# EAGLE design AD5204 (EAGLE 6.3)
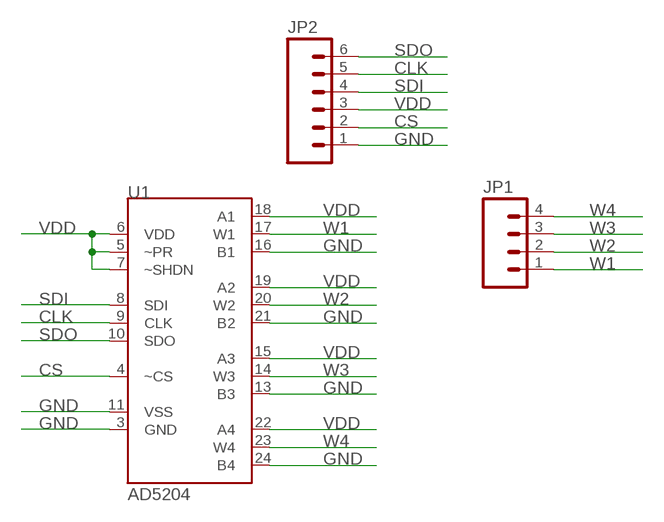
[diagram p0: schematic, sheet 1]

## Parts
JP1  M04PTH  [1X04]
JP2  M06SIP  [1X06]
U1  AD5204  [SO24W]

## Nets
CLK: JP2.5 U1.9(CLK)
CS: JP2.2 U1.4(~CS)
GND: JP2.1 U1.3(GND) U1.11(VSS) U1.13(B3) U1.16(B1) U1.21(B2) U1.24(B4)
SDI: JP2.4 U1.8(SDI)
SDO: JP2.6 U1.10(SDO)
VDD: JP2.3 U1.5(~PR) U1.6(VDD) U1.7(~SHDN) U1.15(A3) U1.18(A1) U1.19(A2) U1.22(A4)
W1: JP1.1 U1.17(W1)
W2: JP1.2 U1.20(W2)
W3: JP1.3 U1.14(W3)
W4: JP1.4 U1.23(W4)

## Library data of the parts
JP1 = SparkFun-Connectors:M04: Header 4 Standard 4-pin 0.1" header. Use with straight break away headers (SKU : PRT-00116), right angle break away headers (PRT-00553), swiss pins (PRT-00743), machine pins (PRT-00117), and female headers (PRT-00115). Molex polarized connector foot print use with SKU : PRT-08231 with associated crimp pins and housings. 1MM SMD Version SKU: PRT-10208
JP2 = SparkFun-Connectors:M06: Header 6 Standard 6-pin 0.1" header. Use with straight break away headers (SKU : PRT-00116), right angle break away headers (PRT-00553), swiss pins (PRT-00743), machine pins (PRT-00117), and female headers (PRT-00115). Molex polarized connector foot print use with SKU : PRT-08094 with associated crimp pins and housings. NOTES ON THE VARIANTS LOCK and LOCK_LONGPADS... This footprint was designed to help hold the alignment of a through-hole component (i.e. 6-pin header) while soldering it into place. You may notice that each hole has been shifted either up or down by 0.005 of an inch from it's more standard position (which is a perfectly straight line). This slight alteration caused the pins (the squares in the middle) to touch the edges of the holes. Because they are alternating, it causes a "brace" to hold the component in place. 0.005 has proven to be the perfect amount of "off-center" position when using our standard breakaway headers. Although looks a little odd when you look at the bare footprint, once you have a header in there, the alteration is very hard to notice. Also,if you push a header all the way into place, it is covered up entirely on the bottom side. This idea of altering the position of holes to aid alignment will be further integrated into the Sparkfun Library for other footprints. It can help hold any component with 3 or more connection pins.
U1 = moje:AD5204

## Net classes
0 default: width 0.3 mm, drill 0.6 mm, clearance 0.3 mm
1 supply: width 0.3 mm, drill 0.6 mm, clearance 0.3 mm to class 0, clearance 0.3 mm
2 POWER: width 0.3 mm, drill 0.6 mm, clearance 0.4 mm to class 0, clearance 0.4 mm to class 1, clearance 0.5 mm

## Board
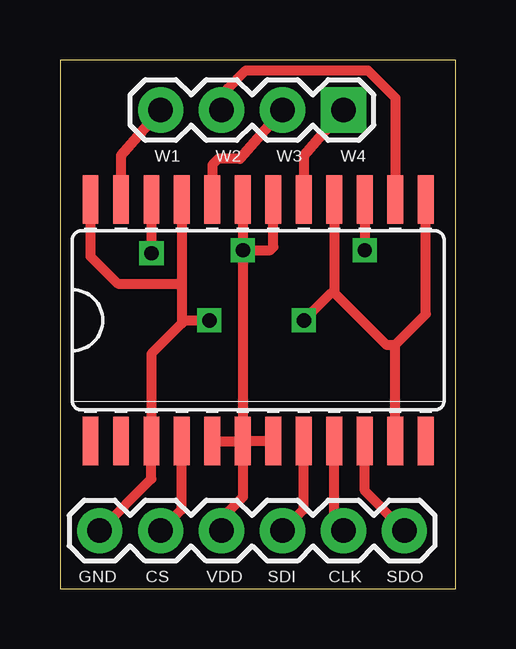
[diagram p1: board, top side]
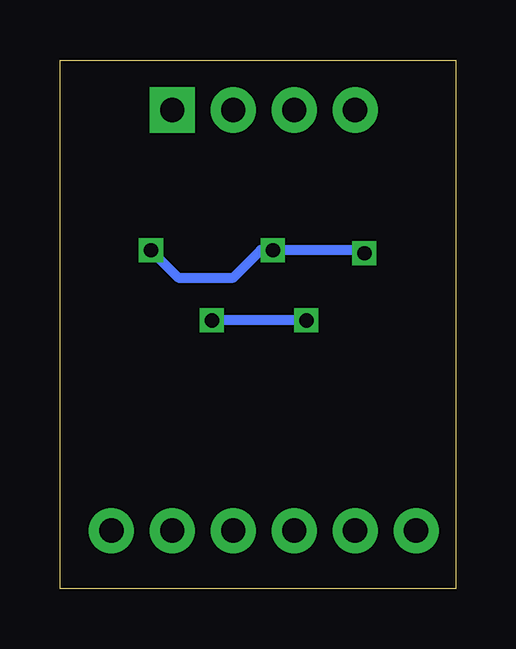
[diagram p2: board, bottom side, seen from below]

Size 16.49 x 22.02 mm. Coordinates in mm from the lower left corner, seen from the top.
Outline: 0,0 16.49,0 16.49,22.02 0,22.02 0,0
Copper layers (1*16): Top 0.035mm / dielectric 1.5mm / Bottom 0.035mm
Design rules "default": minimum track width 10mil, minimum drill 24mil, track to track 8mil, track to pad 8mil, pad to pad 8mil, via to via 8mil, smd to smd 8mil, copper to edge 40mil, drill to drill 8mil, minimum pad ring 10mil, minimum via ring 8mil, stop-mask expansion 4mil, vias tented up to drill 0mil, thermal gap 10mil

### Footprints (pad centres in the part's own frame; a part is rotated, then mirrored left to right if it is on the bottom)
1X04 = drill 1.016 pad 1.88 square: 1 0,0 | drill 1.016 pad 1.88: 2 2.54,0; 3 5.08,0; 4 7.62,0
1X06 = drill 1.016 pad 1.88: 1 0,0; 2 2.54,0; 3 5.08,0; 4 7.62,0; 5 10.16,0; 6 12.7,0
SO24W = smd 0.66 x 2.032: 1 -6.985,-5.029; 2 -5.715,-5.029; 3 -4.445,-5.029; 4 -3.175,-5.029; 5 -1.905,-5.029; 6 -0.635,-5.029; 7 0.635,-5.029; 8 1.905,-5.029; 9 3.175,-5.029; 10 4.445,-5.029; 11 5.715,-5.029; 12 6.985,-5.029; 13 6.985,5.029; 14 5.715,5.029; 15 4.445,5.029; 16 3.175,5.029; 17 1.905,5.029; 18 0.635,5.029; 19 -0.635,5.029; 20 -1.905,5.029; 21 -3.175,5.029; 22 -4.445,5.029; 23 -5.715,5.029; 24 -6.985,5.029

### Placement (x,y rotation side)
JP1  11.81,19.94 180 top
JP2  1.65,2.41 0 top
U1  8.25,11.18 0 top

### Tracks (layer width: path | path; a pad name or v marks a point on that pad's centre or on a via)
CLK
  Top 0.406: JP2.5 11.43,2.79 U1.9
CS
  Top 0.406: JP2.2 5.08,3.3 U1.4
GND  (via drill 0.6)
  Top 0.406: U1.21 5.08,12.7 | 5.08,12.7 5.08,11.05 | 5.08,11.05 3.81,9.78 U1.3 3.81,4.57 JP2.1 | U1.24 1.27,13.84 2.41,12.7 5.08,12.7 | U1.11 13.97,10.16 | 13.97,10.16 15.24,11.43 U1.13 | 13.97,10.16 13.59,10.16 11.43,12.32 | U1.16 11.43,12.32 | 5.08,11.05 5.21,11.18 v6.22,11.18 | v10.16,11.18 11.3,12.32 11.43,12.32
  Bottom 0.406: v6.22,11.18 v10.16,11.18
SDI
  Top 0.406: JP2.4 10.16,3.3 U1.8
SDO
  Top 0.406: JP2.6 12.7,4.06 U1.10
VDD  (via drill 0.6)
  Top 0.406: U1.6 7.62,3.81 6.73,2.92 JP2.3 | U1.19 v7.62,14.1 | v7.62,14.1 U1.6 | U1.22 v3.81,13.97 | v7.62,14.1 8.76,14.1 8.89,14.22 U1.18 | U1.15 v12.7,14.1 | U1.5 U1.6 | U1.7 U1.6
  Bottom 0.406: v3.81,13.97 3.94,14.1 v7.62,14.1 8.13,14.1 9.27,12.95 11.56,12.95 v12.7,14.1
W1
  Top 0.406: JP1.1 10.16,18.03 U1.17
W2
  Top 0.406: JP1.2 7.49,17.91 6.6,17.91 6.35,17.65 U1.20
W3
  Top 0.406: JP1.3 6.99,20.83 7.75,21.59 12.83,21.59 13.97,20.45 U1.14
W4
  Top 0.406: JP1.4 2.54,18.03 U1.23

### Text on the board
tNames: W1 | W2 | W3 | W4 | GND | CS | VDD | SDI | CLK | SDO